# Altium schematic sheet KeyboardMain.SchDoc
size A3
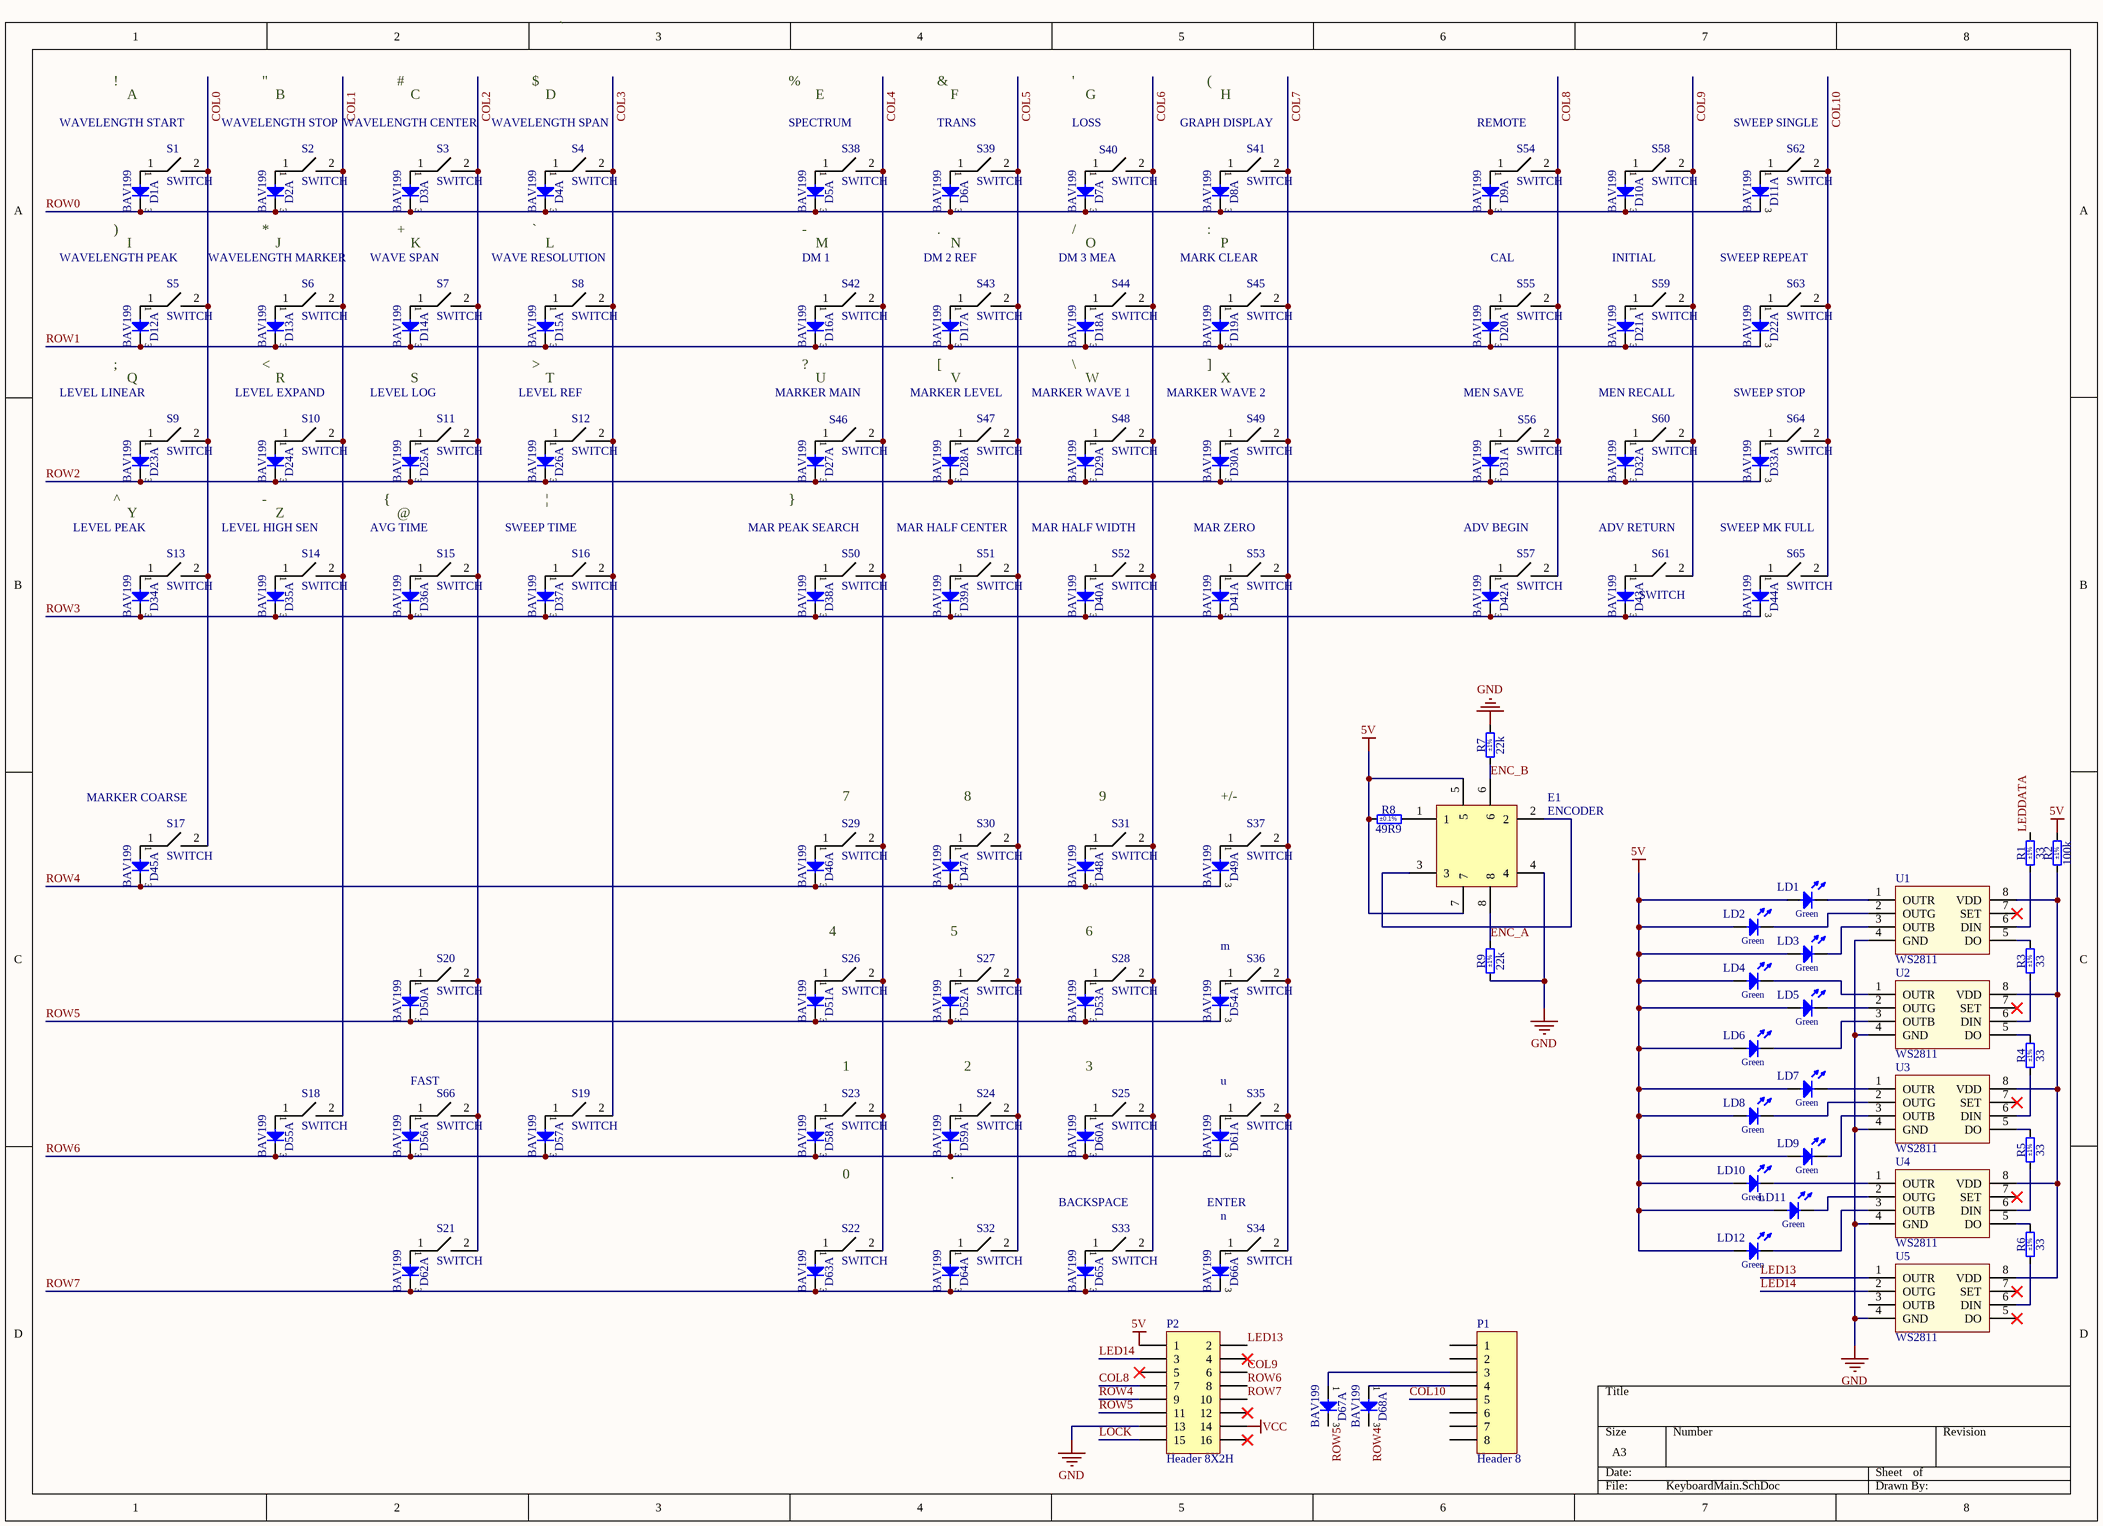
[diagram p0: KeyboardMain.SchDoc]

## Parts
D1  BAV199  [SOT95P240X110-3N]  (part A of 2)
D2  BAV199  [SOT95P240X110-3N]  (part A of 2)
D3  BAV199  [SOT95P240X110-3N]  (part A of 2)
D4  BAV199  [SOT95P240X110-3N]  (part A of 2)
D5  BAV199  [SOT95P240X110-3N]  (part A of 2)
D6  BAV199  [SOT95P240X110-3N]  (part A of 2)
D7  BAV199  [SOT95P240X110-3N]  (part A of 2)
D8  BAV199  [SOT95P240X110-3N]  (part A of 2)
D9  BAV199  [SOT95P240X110-3N]  (part A of 2)
D10  BAV199  [SOT95P240X110-3N]  (part A of 2)
D11  BAV199  [SOT95P240X110-3N]  (part A of 2)
D12  BAV199  [SOT95P240X110-3N]  (part A of 2)
D13  BAV199  [SOT95P240X110-3N]  (part A of 2)
D14  BAV199  [SOT95P240X110-3N]  (part A of 2)
D15  BAV199  [SOT95P240X110-3N]  (part A of 2)
D16  BAV199  [SOT95P240X110-3N]  (part A of 2)
D17  BAV199  [SOT95P240X110-3N]  (part A of 2)
D18  BAV199  [SOT95P240X110-3N]  (part A of 2)
D19  BAV199  [SOT95P240X110-3N]  (part A of 2)
D20  BAV199  [SOT95P240X110-3N]  (part A of 2)
D21  BAV199  [SOT95P240X110-3N]  (part A of 2)
D22  BAV199  [SOT95P240X110-3N]  (part A of 2)
D23  BAV199  [SOT95P240X110-3N]  (part A of 2)
D24  BAV199  [SOT95P240X110-3N]  (part A of 2)
D25  BAV199  [SOT95P240X110-3N]  (part A of 2)
D26  BAV199  [SOT95P240X110-3N]  (part A of 2)
D27  BAV199  [SOT95P240X110-3N]  (part A of 2)
D28  BAV199  [SOT95P240X110-3N]  (part A of 2)
D29  BAV199  [SOT95P240X110-3N]  (part A of 2)
D30  BAV199  [SOT95P240X110-3N]  (part A of 2)
D31  BAV199  [SOT95P240X110-3N]  (part A of 2)
D32  BAV199  [SOT95P240X110-3N]  (part A of 2)
D33  BAV199  [SOT95P240X110-3N]  (part A of 2)
D34  BAV199  [SOT95P240X110-3N]  (part A of 2)
D35  BAV199  [SOT95P240X110-3N]  (part A of 2)
D36  BAV199  [SOT95P240X110-3N]  (part A of 2)
D37  BAV199  [SOT95P240X110-3N]  (part A of 2)
D38  BAV199  [SOT95P240X110-3N]  (part A of 2)
D39  BAV199  [SOT95P240X110-3N]  (part A of 2)
D40  BAV199  [SOT95P240X110-3N]  (part A of 2)
D41  BAV199  [SOT95P240X110-3N]  (part A of 2)
D42  BAV199  [SOT95P240X110-3N]  (part A of 2)
D43  BAV199  [SOT95P240X110-3N]  (part A of 2)
D44  BAV199  [SOT95P240X110-3N]  (part A of 2)
D45  BAV199  [SOT95P240X110-3N]  (part A of 2)
D46  BAV199  [SOT95P240X110-3N]  (part A of 2)
D47  BAV199  [SOT95P240X110-3N]  (part A of 2)
D48  BAV199  [SOT95P240X110-3N]  (part A of 2)
D49  BAV199  [SOT95P240X110-3N]  (part A of 2)
D50  BAV199  [SOT95P240X110-3N]  (part A of 2)
D51  BAV199  [SOT95P240X110-3N]  (part A of 2)
D52  BAV199  [SOT95P240X110-3N]  (part A of 2)
D53  BAV199  [SOT95P240X110-3N]  (part A of 2)
D54  BAV199  [SOT95P240X110-3N]  (part A of 2)
D55  BAV199  [SOT95P240X110-3N]  (part A of 2)
D56  BAV199  [SOT95P240X110-3N]  (part A of 2)
D57  BAV199  [SOT95P240X110-3N]  (part A of 2)
D58  BAV199  [SOT95P240X110-3N]  (part A of 2)
D59  BAV199  [SOT95P240X110-3N]  (part A of 2)
D60  BAV199  [SOT95P240X110-3N]  (part A of 2)
D61  BAV199  [SOT95P240X110-3N]  (part A of 2)
D62  BAV199  [SOT95P240X110-3N]  (part A of 2)
D63  BAV199  [SOT95P240X110-3N]  (part A of 2)
D64  BAV199  [SOT95P240X110-3N]  (part A of 2)
D65  BAV199  [SOT95P240X110-3N]  (part A of 2)
D66  BAV199  [SOT95P240X110-3N]  (part A of 2)
D67  BAV199  [SOT95P240X110-3N]  (part A of 2)
D68  BAV199  [SOT95P240X110-3N]  (part A of 2)
E1  ENCODER  [ENCODER]
LD1  Green  [LED_3MM_GREEN_1C-2A]
LD2  Green  [LED_3MM_GREEN_1C-2A]
LD3  Green  [LED_3MM_GREEN_1C-2A]
LD4  Green  [LED_3MM_GREEN_1C-2A]
LD5  Green  [LED_3MM_GREEN_1C-2A]
LD6  Green  [LED_3MM_GREEN_1C-2A]
LD7  Green  [LED_3MM_GREEN_1C-2A]
LD8  Green  [LED_3MM_GREEN_1C-2A]
LD9  Green  [LED_3MM_GREEN_1C-2A]
LD10  Green  [LED_3MM_GREEN_1C-2A]
LD11  Green  [LED_3MM_GREEN_1C-2A]
LD12  Green  [LED_3MM_GREEN_1C-2A]
P1  Header 8  [HDR1X8]
P2  Header 8X2H  [HDR2X8H]
R1  33  Tolerance: ±1%  [RESC2012X60N]
R2  100k  Tolerance: ±1%  [RESC2012X60N]
R3  33  Tolerance: ±1%  [RESC2012X60N]
R4  33  Tolerance: ±1%  [RESC2012X60N]
R5  33  Tolerance: ±1%  [RESC2012X60N]
R6  33  Tolerance: ±1%  [RESC2012X60N]
R7  22k  Tolerance: ±1%  [RESC2012X60N]
R8  49R9  Tolerance: ±0.1%  [RESC2012X60N]
R9  22k  Tolerance: ±1%  [RESC2012X60N]
S1  SWITCH  [SWITCH]
S2  SWITCH  [SWITCH]
S3  SWITCH  [SWITCH]
S4  SWITCH  [SWITCH]
S5  SWITCH  [SWITCH]
S6  SWITCH  [SWITCH]
S7  SWITCH  [SWITCH]
S8  SWITCH  [SWITCH]
S9  SWITCH  [SWITCH]
S10  SWITCH  [SWITCH]
S11  SWITCH  [SWITCH]
S12  SWITCH  [SWITCH]
S13  SWITCH  [SWITCH]
S14  SWITCH  [SWITCH]
S15  SWITCH  [SWITCH]
S16  SWITCH  [SWITCH]
S17  SWITCH  [SWITCH]
S18  SWITCH  [SWITCH]
S19  SWITCH  [SWITCH]
S20  SWITCH  [SWITCH]
S21  SWITCH  [SWITCH]
S22  SWITCH  [SWITCH]
S23  SWITCH  [SWITCH]
S24  SWITCH  [SWITCH]
S25  SWITCH  [SWITCH]
S26  SWITCH  [SWITCH]
S27  SWITCH  [SWITCH]
S28  SWITCH  [SWITCH]
S29  SWITCH  [SWITCH]
S30  SWITCH  [SWITCH]
S31  SWITCH  [SWITCH]
S32  SWITCH  [SWITCH]
S33  SWITCH  [SWITCH]
S34  SWITCH  [SWITCH]
S35  SWITCH  [SWITCH]
S36  SWITCH  [SWITCH]
S37  SWITCH  [SWITCH]
S38  SWITCH  [SWITCH]
S39  SWITCH  [SWITCH]
S40  SWITCH  [SWITCH]
S41  SWITCH  [SWITCH]
S42  SWITCH  [SWITCH]
S43  SWITCH  [SWITCH]
S44  SWITCH  [SWITCH]
S45  SWITCH  [SWITCH]
S46  SWITCH  [SWITCH]
S47  SWITCH  [SWITCH]
S48  SWITCH  [SWITCH]
S49  SWITCH  [SWITCH]
S50  SWITCH  [SWITCH]
S51  SWITCH  [SWITCH]
S52  SWITCH  [SWITCH]
S53  SWITCH  [SWITCH]
S54  SWITCH  [SWITCH]
S55  SWITCH  [SWITCH]
S56  SWITCH  [SWITCH]
S57  SWITCH  [SWITCH]
S58  SWITCH  [SWITCH]
S59  SWITCH  [SWITCH]
S60  SWITCH  [SWITCH]
S61  SWITCH  [SWITCH]
S62  SWITCH  [SWITCH]
S63  SWITCH  [SWITCH]
S64  SWITCH  [SWITCH]
S65  SWITCH  [SWITCH]
S66  SWITCH  [SWITCH]
U1  WS2811  [SOP-8]
U2  WS2811  [SOP-8]
U3  WS2811  [SOP-8]
U4  WS2811  [SOP-8]
U5  WS2811  [SOP-8]

## Nets
5V: E1.5 E1.7 LD1.2(A) LD2.2(A) LD3.2(A) LD4.2(A) LD5.2(A) LD6.2(A) LD7.2(A) LD8.2(A) LD9.2(A) LD10.2(A) LD11.2(A) LD12.2(A) P2.1 R2.2 R8.1
GND: E1.4 P2.13 R7.2 R9.1 U1.4(GND) U2.4(GND) U3.4(GND) U4.4(GND) U5.4(GND)
VCC: P2.14
COL0: S1.2 S5.2 S9.2 S13.2 S17.2
COL1: S2.2 S6.2 S10.2 S14.2 S18.2
COL2: S3.2 S7.2 S11.2 S15.2 S20.2 S21.2 S66.2
COL3: S4.2 S8.2 S12.2 S16.2 S19.2
COL4: S22.2 S23.2 S26.2 S29.2 S38.2 S42.2 S46.2 S50.2
COL5: S24.2 S27.2 S30.2 S32.2 S39.2 S43.2 S47.2 S51.2
COL6: S25.2 S28.2 S31.2 S33.2 S40.2 S44.2 S48.2 S52.2
COL7: S34.2 S35.2 S36.2 S37.2 S41.2 S45.2 S49.2 S53.2
COL8: P2.7 S54.2 S55.2 S56.2 S57.2
COL9: P2.6 S58.2 S59.2 S60.2 S61.2
COL10: P1.5 S62.2 S63.2 S64.2 S65.2
ENC_A: E1.8 R9.2
ENC_B: E1.6 R7.1
LED13: P2.2 U5.1(OUTR)
LED14: P2.3 U5.2(OUTG)
LEDDATA: R1.2
LOCK: P2.15
ROW0: D1.3(COMAC) D2.3(COMAC) D3.3(COMAC) D4.3(COMAC) D5.3(COMAC) D6.3(COMAC) D7.3(COMAC) D8.3(COMAC) D9.3(COMAC) D10.3(COMAC) D11.3(COMAC)
ROW1: D12.3(COMAC) D13.3(COMAC) D14.3(COMAC) D15.3(COMAC) D16.3(COMAC) D17.3(COMAC) D18.3(COMAC) D19.3(COMAC) D20.3(COMAC) D21.3(COMAC) D22.3(COMAC)
ROW2: D23.3(COMAC) D24.3(COMAC) D25.3(COMAC) D26.3(COMAC) D27.3(COMAC) D28.3(COMAC) D29.3(COMAC) D30.3(COMAC) D31.3(COMAC) D32.3(COMAC) D33.3(COMAC)
ROW3: D34.3(COMAC) D35.3(COMAC) D36.3(COMAC) D37.3(COMAC) D38.3(COMAC) D39.3(COMAC) D40.3(COMAC) D41.3(COMAC) D42.3(COMAC) D43.3(COMAC) D44.3(COMAC)
ROW4: D45.3(COMAC) D46.3(COMAC) D47.3(COMAC) D48.3(COMAC) D49.3(COMAC) D68.3(COMAC) P2.9
ROW5: D50.3(COMAC) D51.3(COMAC) D52.3(COMAC) D53.3(COMAC) D54.3(COMAC) D67.3(COMAC) P2.11
ROW6: D55.3(COMAC) D56.3(COMAC) D57.3(COMAC) D58.3(COMAC) D59.3(COMAC) D60.3(COMAC) D61.3(COMAC) P2.8
ROW7: D62.3(COMAC) D63.3(COMAC) D64.3(COMAC) D65.3(COMAC) D66.3(COMAC) P2.10
NetD1_1: D1.1(A) S1.1
NetD2_1: D2.1(A) S2.1
NetD3_1: D3.1(A) S3.1
NetD4_1: D4.1(A) S4.1
NetD5_1: D5.1(A) S38.1
NetD6_1: D6.1(A) S39.1
NetD7_1: D7.1(A) S40.1
NetD8_1: D8.1(A) S41.1
NetD9_1: D9.1(A) S54.1
NetD10_1: D10.1(A) S58.1
NetD11_1: D11.1(A) S62.1
NetD12_1: D12.1(A) S5.1
NetD13_1: D13.1(A) S6.1
NetD14_1: D14.1(A) S7.1
NetD15_1: D15.1(A) S8.1
NetD16_1: D16.1(A) S42.1
NetD17_1: D17.1(A) S43.1
NetD18_1: D18.1(A) S44.1
NetD19_1: D19.1(A) S45.1
NetD20_1: D20.1(A) S55.1
NetD21_1: D21.1(A) S59.1
NetD22_1: D22.1(A) S63.1
NetD23_1: D23.1(A) S9.1
NetD24_1: D24.1(A) S10.1
NetD25_1: D25.1(A) S11.1
NetD26_1: D26.1(A) S12.1
NetD27_1: D27.1(A) S46.1
NetD28_1: D28.1(A) S47.1
NetD29_1: D29.1(A) S48.1
NetD30_1: D30.1(A) S49.1
NetD31_1: D31.1(A) S56.1
NetD32_1: D32.1(A) S60.1
NetD33_1: D33.1(A) S64.1
NetD34_1: D34.1(A) S13.1
NetD35_1: D35.1(A) S14.1
NetD36_1: D36.1(A) S15.1
NetD37_1: D37.1(A) S16.1
NetD38_1: D38.1(A) S50.1
NetD39_1: D39.1(A) S51.1
NetD40_1: D40.1(A) S52.1
NetD41_1: D41.1(A) S53.1
NetD42_1: D42.1(A) S57.1
NetD43_1: D43.1(A) S61.1
NetD44_1: D44.1(A) S65.1
NetD45_1: D45.1(A) S17.1
NetD46_1: D46.1(A) S29.1
NetD47_1: D47.1(A) S30.1
NetD48_1: D48.1(A) S31.1
NetD49_1: D49.1(A) S37.1
NetD50_1: D50.1(A) S20.1
NetD51_1: D51.1(A) S26.1
NetD52_1: D52.1(A) S27.1
NetD53_1: D53.1(A) S28.1
NetD54_1: D54.1(A) S36.1
NetD55_1: D55.1(A) S18.1
NetD56_1: D56.1(A) S66.1
NetD57_1: D57.1(A) S19.1
NetD58_1: D58.1(A) S23.1
NetD59_1: D59.1(A) S24.1
NetD60_1: D60.1(A) S25.1
NetD61_1: D61.1(A) S35.1
NetD62_1: D62.1(A) S21.1
NetD63_1: D63.1(A) S22.1
NetD64_1: D64.1(A) S32.1
NetD65_1: D65.1(A) S33.1
NetD66_1: D66.1(A) S34.1
NetD67_1: D67.1(A) P1.3
NetD68_1: D68.1(A) P1.4
NetE1_1: E1.1 R8.2
NetE1_2: E1.2 E1.3
NetLD1_1: LD1.1(C) U1.1(OUTR)
NetLD2_1: LD2.1(C) U1.2(OUTG)
NetLD3_1: LD3.1(C) U1.3(OUTB)
NetLD4_1: LD4.1(C) U2.1(OUTR)
NetLD5_1: LD5.1(C) U2.2(OUTG)
NetLD6_1: LD6.1(C) U2.3(OUTB)
NetLD7_1: LD7.1(C) U3.1(OUTR)
NetLD8_1: LD8.1(C) U3.2(OUTG)
NetLD9_1: LD9.1(C) U3.3(OUTB)
NetLD10_1: LD10.1(C) U4.1(OUTR)
NetLD11_1: LD11.1(C) U4.2(OUTG)
NetLD12_1: LD12.1(C) U4.3(OUTB)
NetR1_1: R1.1 U1.6(DIN)
NetR2_1: R2.1 U1.8(VDD) U2.8(VDD) U3.8(VDD) U4.8(VDD) U5.8(VDD)
NetR3_1: R3.1 U2.6(DIN)
NetR3_2: R3.2 U1.5(DO)
NetR4_1: R4.1 U3.6(DIN)
NetR4_2: R4.2 U2.5(DO)
NetR5_1: R5.1 U4.6(DIN)
NetR5_2: R5.2 U3.5(DO)
NetR6_1: R6.1 U5.6(DIN)
NetR6_2: R6.2 U4.5(DO)

Not connected (* = marked no-connect by the designer): P1 1 2 6 7 8; P2 4* 5* 12* 16*; U1 7(SET)*; U2 7(SET)*; U3 7(SET)*; U4 7(SET)*; U5 3(OUTB) 5(DO)* 7(SET)*

## Notes on the sheet
- `
- WAVELENGTH START
- !
- A
- WAVELENGTH STOP
- "
- B
- WAVELENGTH CENTER
- #
- C
- WAVELENGTH SPAN
- $
- D
- SPECTRUM
- %
- E
- TRANS
- &
- F
- LOSS
- '
- G
- GRAPH DISPLAY
- (
- H
- REMOTE
- SWEEP SINGLE
- WAVELENGTH PEAK
- (near D1) )
- (near D1) I
- WAVELENGTH MARKER
- (near D2) *
- J
- WAVE SPAN
- (near D3) +
- K
- WAVE RESOLUTION
- (near D4) `
- L
- DM 1
- (near D5) -
- M
- DM 2 REF
- (near D6) .
- N
- DM 3 MEA
- (near D7) /
- O
- MARK CLEAR
- (near D8) :
- P
- CAL
- INITIAL
- SWEEP REPEAT
- LEVEL LINEAR
- (near D12) ;
- (near D12) Q
- LEVEL EXPAND
- (near D13) <
- R
- LEVEL LOG
- S
- LEVEL REF
- (near D15) >
- T
- MARKER MAIN
- (near D16) ?
- U
- MARKER LEVEL
- (near D17) [
- V
- MARKER WAVE 1
- (near D18) \
- W
- MARKER WAVE 2
- (near D19) ]
- X
- MEN SAVE
- MEN RECALL
- SWEEP STOP
- LEVEL PEAK
- (near D23) ^
- (near D23) Y
- LEVEL HIGH SEN
- (near D24) -
- Z
- AVG TIME
- (near D25) {
- (near D25) @
- SWEEP TIME
- (near D26) |
- MAR PEAK SEARCH
- (near D27) }
- MAR HALF CENTER
- MAR HALF WIDTH
- MAR ZERO
- ADV BEGIN
- ADV RETURN
- SWEEP MK FULL
- MARKER COARSE
- 7
- 8
- 9
- +/-
- 4
- 5
- 6
- m
- 1
- 2
- 3
- FAST
- u
- 0
- (near D59) .
- BACKSPACE
- ENTER
- n

## Library data of the parts
D1-D68 = BAV199: Serial Diode; Part Description: Low-Leakage Double Diode; Manufacturer: NXP SEMICONDUCTORS; Voltage: 75V; Power: 250mW; PressFit: No; Bonding: No; Part Number: BAV199; Component Kind: Standard; Component Type: Standard; Device: BAV199; PackageDescription: SOT, 0.95mm Pitch; 3 Pin, 1.40mm W X 3.00mm L X 1.10mm H body, IPC Medium Density; Manufacturer Part Number: BAV199; Pin Count: 3; Case: SOT23-3; Mounted: Yes; Socket: No; SMD: Yes; Sense: No; ComponentHeight: 1.1mm; HelpURL: \\cern.ch\dfs\Applications\Altium\Datasheets\BAV199.pdf; Author: CERN DEM JMW; CreateDate: 11/21/2008; LatestRevisionDate: 11/21/2008
LD1-LD12 = LED_AVAGO_HLMP-1790: LED Green 1C 2A; Part Description: 3mm Green LED; Manufacturer: AVAGO TECHNOLOGIES; PressFit: No; Bonding: No; Part Number: LED_AVAGO_HLMP-1790; Component Kind: Standard; Component Type: Standard; Color: Green; PackageDescription: LED, Green, Body Dia. 3.43 mm, Pin spacing 2.54mm; Manufacturer Part Number: HLMP-1790; Pin Count: 2; Mounted: Yes; Socket: No; SMD: No; Sense: No; ComponentHeight: 6.35mm(min); HelpURL: \\cern.ch\dfs\Applications\Altium\Datasheets\LED_AVAGO_HLMP-1790.pdf; Author: CERN DEM JLC; CreateDate: 6/12/2008; LatestRevisionDate: 3/17/2010
P1 = Header 8: Header, 8-Pin; LatestRevisionDate: 17-Jul-2002; LatestRevisionNote: Re-released for DXP Platform.; Publisher: Altium Limited
P2 = Header 8X2H: Header, 8-Pin, Dual row, Right Angle; LatestRevisionDate: 17-Jul-2002; LatestRevisionNote: Re-released for DXP Platform.; Publisher: Altium Limited
R1 R3-R6 = R0805_33R_1%_0.125W_100PPM: Resistor - 1%; Part Description: General Purpose Thick Film Chip Resistor; Manufacturer: GENERIC; Manufacturer1 Part Number: NRC10F33R0TRF; Power: 0.125W; TC: ±100ppm/°C; PressFit: No; Part Number: R0805_33R_1%_0.125W_100PPM; Component Kind: Standard; Component Type: Standard; Pin Count: 2; Value: 33; Status: Preferred; Manufacturer Part Number: R0805_33R_1%_0.125W_100PPM; Case: 0805; Mounted: Yes; Sense: No; Socket: No; SMD: Yes; Manufacturer1 Example: NIC COMPONENT; Manufacturer1 ComponentHeight: 0.6mm; HelpURL: \\cern.ch\dfs\Applications\Altium\Datasheets\R0805_NIC_NRC.pdf; Author: CERN DEM JLC; CreateDate: 12/3/2007; LatestRevisionDate: 3/13/2008
R2 = R0805_100K_1%_0.125W_100PPM: Resistor - 1%; Part Description: General Purpose Thick Film Chip Resistor; Manufacturer: GENERIC; Manufacturer1 Part Number: NRC10F1003TRF; Power: 0.125W; TC: ±100ppm/°C; PressFit: No; Part Number: R0805_100K_1%_0.125W_100PPM; Component Kind: Standard; Component Type: Standard; Pin Count: 2; Value: 100k; Status: Preferred; Manufacturer Part Number: R0805_100K_1%_0.125W_100PPM; Case: 0805; Mounted: Yes; Sense: No; Socket: No; SMD: Yes; Manufacturer1 Example: NIC COMPONENT; Manufacturer1 ComponentHeight: 0.6mm; HelpURL: \\cern.ch\dfs\Applications\Altium\Datasheets\R0805_NIC_NRC.pdf; Author: CERN DEM JLC; CreateDate: 12/3/2007; LatestRevisionDate: 3/13/2008
R7 R9 = R0805_22K_1%_0.125W_100PPM: Resistor - 1%; Part Description: General Purpose Thick Film Chip Resistor; Manufacturer: GENERIC; Manufacturer1 Part Number: NRC10F2202TRF; Power: 0.125W; TC: ±100ppm/°C; PressFit: No; Part Number: R0805_22K_1%_0.125W_100PPM; Component Kind: Standard; Component Type: Standard; Pin Count: 2; Value: 22k; Status: Preferred; Manufacturer Part Number: R0805_22K_1%_0.125W_100PPM; Case: 0805; Mounted: Yes; Sense: No; Socket: No; SMD: Yes; Manufacturer1 Example: NIC COMPONENT; Manufacturer1 ComponentHeight: 0.6mm; HelpURL: \\cern.ch\dfs\Applications\Altium\Datasheets\R0805_NIC_NRC.pdf; Author: CERN DEM JLC; CreateDate: 12/3/2007; LatestRevisionDate: 3/13/2008
R8 = R0805_49R9_0.1%_0.125W_25PPM: Resistor - 0.1%; Part Description: Thin Film Chip Resistor; Manufacturer: GENERIC; Manufacturer1 Part Number: ERA6AEB49R9V; Power: 0.125W; TC: ±25ppm; PressFit: No; Part Number: R0805_49R9_0.1%_0.125W_25PPM; Component Kind: Standard; Component Type: Standard; Pin Count: 2; Value: 49R9; Status: Not Recommended; Manufacturer Part Number: R0805_49R9_0.1%_0.125W_25PPM; Case: 0805; Mounted: Yes; Sense: No; Socket: No; SMD: Yes; Manufacturer1 Example: PANASONIC; Manufacturer1 ComponentHeight: 0.6mm; HelpURL: \\cern.ch\dfs\Applications\Altium\Datasheets\R0805_PANASONIC_ERA.pdf; Author: CERN DEM JLC; CreateDate: 6/20/2011; LatestRevisionDate: 6/20/2011
U1-U5 = WS2811: Supplier 1: Arrow Electronics; Supplier Part Number 1: 1378